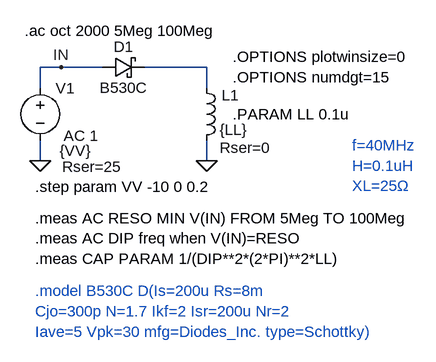
[diagram p0: schematic Fig_11-39_Diode-reso_MEAS.asc]
Fig_11-39_Diode-reso_MEAS.asc, the LTspice schematic file:
Version 4
SHEET 1 1128 680
WIRE 80 192 48 192
WIRE 144 192 80 192
WIRE 304 192 208 192
WIRE 48 224 48 192
WIRE 304 224 304 192
WIRE 48 336 48 304
WIRE 304 336 304 304
FLAG 48 336 0
FLAG 304 336 0
FLAG 80 192 IN
SYMBOL ind 288 208 R0
WINDOW 39 36 108 Left 2
WINDOW 0 39 27 Left 2
SYMATTR SpiceLine Rser=0
SYMATTR InstName L1
SYMATTR Value {LL}
SYMBOL schottky 144 208 R270
WINDOW 0 32 32 VTop 2
WINDOW 3 0 32 VBottom 2
SYMATTR InstName D1
SYMATTR Value B530C
SYMATTR Description Diode
SYMATTR Type diode
SYMBOL voltage 48 208 R0
WINDOW 3 30 112 Left 2
WINDOW 123 36 89 Left 2
WINDOW 39 34 137 Left 2
SYMATTR Value {VV}
SYMATTR Value2 AC 1
SYMATTR SpiceLine Rser=25
SYMATTR InstName V1
TEXT 24 136 Left 2 !.ac oct 2000 5Meg 100Meg
TEXT 40 376 Left 2 !.step param VV -10 0 0.2
TEXT 40 424 Left 2 !.meas AC RESO MIN V(IN) FROM 5Meg TO 100Meg\n.meas AC DIP freq when V(IN)=RESO\n.meas CAP PARAM 1/(DIP**2*(2*PI)**2*LL)
TEXT 40 536 Left 2 ;.model B530C D(Is=200u Rs=8m \nCjo=300p N=1.7 Ikf=2 Isr=200u Nr=2 \nIave=5 Vpk=30 mfg=Diodes_Inc. type=Schottky)
TEXT 344 176 Left 2 !.OPTIONS plotwinsize=0\n.OPTIONS numdgt=15
TEXT 528 312 Left 2 ;f=40MHz\nH=0.1uH\nXL=25Ω
TEXT 344 264 Left 2 !.PARAM LL 0.1u

The netlist it stands for:
* Fig_11-39_Diode-reso_MEAS.asc
L1 N001 0 {LL} Rser=0
D1 IN N001 B530C
V1 IN 0 {VV} AC 1 Rser=25
.model D D
.lib standard.dio
.ac oct 2000 5Meg 100Meg
.step param VV -10 0 0.2
.meas AC RESO MIN V(IN) FROM 5Meg TO 100Meg
.meas AC DIP freq when V(IN)=RESO
.meas CAP PARAM 1/(DIP**2*(2*PI)**2*LL)
* .model B530C D(Is=200u Rs=8m
* Cjo=300p N=1.7 Ikf=2 Isr=200u Nr=2
* Iave=5 Vpk=30 mfg=Diodes_Inc. type=Schottky)
.OPTIONS plotwinsize=0
.OPTIONS numdgt=15
* f=40MHz
* H=0.1uH
* XL=25Ω
.PARAM LL 0.1u
.backanno
.end